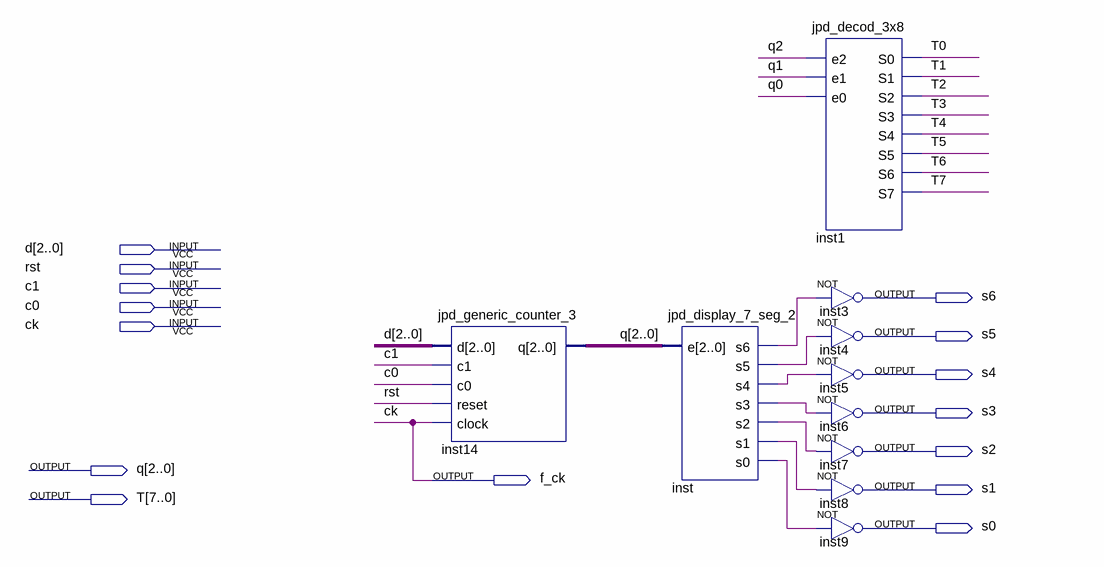
[diagram p0: schematic sheet]
// Quartus schematic jpd_counter_display.bdf as structural Verilog: 10 symbols, 15 pins
module jpd_counter_display (
  input  [2:0] d,
  input  rst,
  input  c1,
  input  c0,
  input  ck,
  output s6,
  output s5,
  output s4,
  output s3,
  output s2,
  output [2:0] q,
  output f_ck,
  output s1,
  output [7:0] T,
  output s0
);

  wire inst_s0, inst_s1, inst_s2, inst_s3, inst_s4, inst_s5, inst_s6;

  jpd_generic_counter_3 inst14 (.d(d), .c1(c1), .c0(c0), .reset(rst), .clock(ck), .q(q));
  jpd_display_7_seg_2 inst (
    .e(q), .s6(inst_s6), .s5(inst_s5), .s4(inst_s4), .s3(inst_s3), .s2(inst_s2), .s1(inst_s1), .s0(inst_s0));
  jpd_decod_3x8 inst1 (
    .e2(q[2]), .e1(q[1]), .e0(q[0]), .S0(T[0]), .S1(T[1]), .S2(T[2]), .S3(T[3]), .S4(T[4]), .S5(T[5]),
    .S6(T[6]), .S7(T[7]));
  not inst3 (s6, inst_s6);
  not inst4 (s5, inst_s5);
  not inst5 (s4, inst_s4);
  not inst6 (s3, inst_s3);
  not inst7 (s2, inst_s2);
  not inst8 (s1, inst_s1);
  not inst9 (s0, inst_s0);

  assign f_ck = ck;
endmodule
